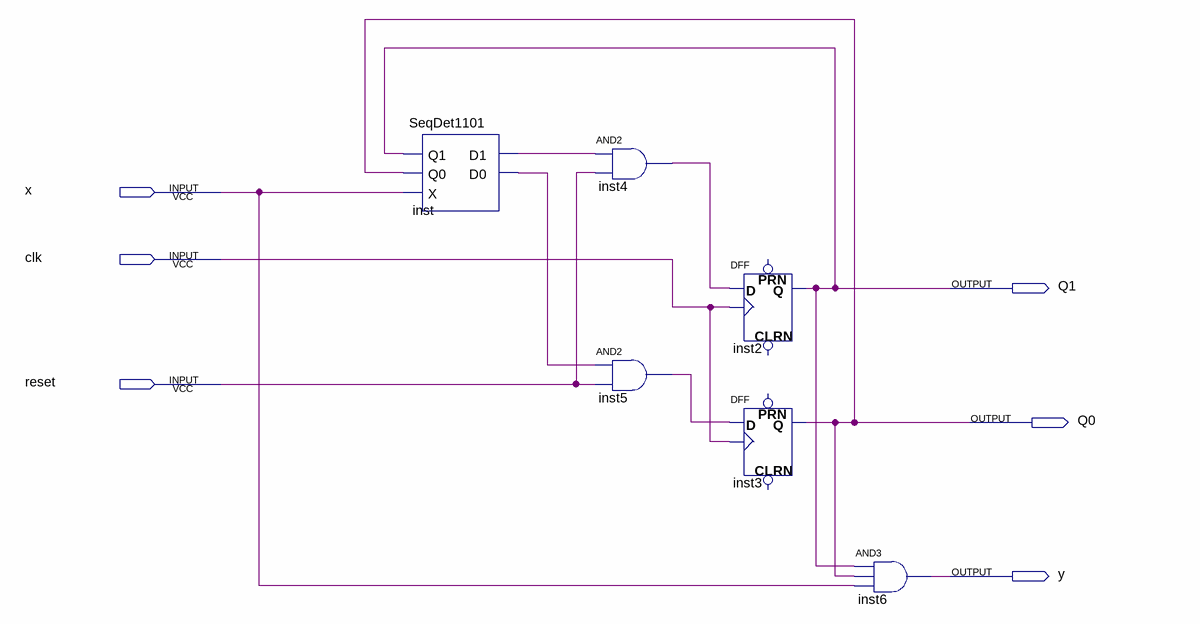
[diagram p0: schematic sheet]
// Quartus schematic SeqDet1011completo.bdf as structural Verilog: 6 symbols, 6 pins
module SeqDet1011completo (
  input  x,
  input  clk,
  input  reset,
  output Q1,
  output Q0,
  output y
);

  wire inst4_out, inst5_out, inst_d0, inst_d1;

  SeqDet1101 inst (.Q1(Q1), .Q0(Q0), .X(x), .D1(inst_d1), .D0(inst_d0));
  and inst4 (inst4_out, inst_d1, reset);
  and inst5 (inst5_out, inst_d0, reset);
  DFF inst2 (.CLK(clk), .D(inst4_out), .Q(Q1));  // open: CLRN, PRN
  DFF inst3 (.CLK(clk), .D(inst5_out), .Q(Q0));  // open: CLRN, PRN
  and inst6 (y, Q1, Q0, x);
endmodule
